# Altium schematic sheet Battery1.SchDoc
size A
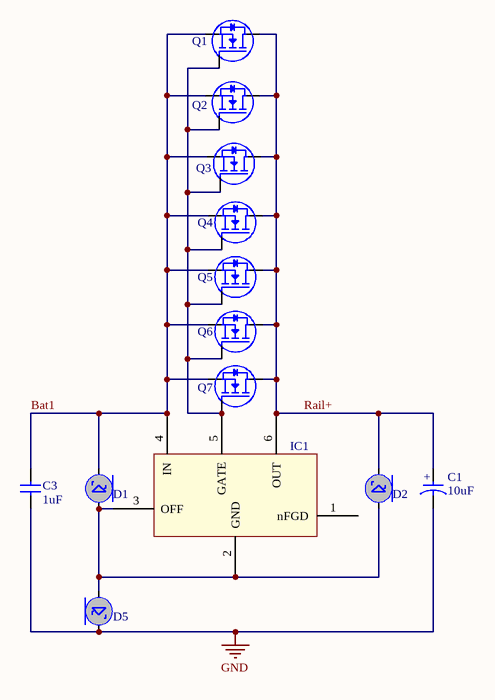
[diagram p0: Battery1.SchDoc]

## Parts
C1  value 10uF  [CAP22uF100V]  (hidden comment: CapPol)
C3  value 1uF  [CAPC1206]  (hidden comment: Cap)
D1  Schottky  [SS110-TP]  (value not drawn)
D2  SMBJ100A-13-F  [SMBJ100A-13-F]  (value not drawn)
D5  Schottky  [SS110-TP]  (value not drawn)
IC1  LM5050MK-2/NOPB  [LM5050MK-2/NOPB]  (value not drawn)
Q1  CSD19502Q5B  [CSD19502Q5B]  (value not drawn)
Q2  CSD19502Q5B  [CSD19502Q5B]  (value not drawn)
Q3  CSD19502Q5B  [CSD19502Q5B]  (value not drawn)
Q4  CSD19502Q5B  [CSD19502Q5B]  (value not drawn)
Q5  CSD19502Q5B  [CSD19502Q5B]  (value not drawn)
Q6  CSD19502Q5B  [CSD19502Q5B]  (value not drawn)
Q7  CSD19502Q5B  [CSD19502Q5B]  (value not drawn)

## Nets
GND: C1.2(B) C3.2(B) D5.C
Bat1: C3.1(A) D1.C IC1.4(IN) Q1.S Q2.S Q3.S Q4.S Q5.S Q6.S Q7.S
Rail+: C1.1(A) D2.C IC1.6(OUT) Q1.D Q2.D Q3.D Q4.D Q5.D Q6.D Q7.D
NetD1_A: D1.A D2.A D5.A IC1.2(GND) IC1.3(OFF)
NetIC1_5: IC1.5(GATE) Q1.G Q2.G Q3.G Q4.G Q5.G Q6.G Q7.G

Not connected (* = marked no-connect by the designer): IC1 1(nFGD)

## Notes on the sheet
- (in symbol CapPol) +

## Library data of the parts
D1 D5 = Schottky: Schottky Diode Template; Supplier 1: Digi-Key; Supplier Part Number 1: SS110-TPDKR-ND
D2 = SMBJ100A-13-F: TVS DIODE 100VWM 162VC SMB; Supplier 1: Digi-Key; Supplier Part Number 1: SMBJ100A-FDIDKR-ND
IC1 = LM5050MK-2/NOPB: IC OR CTRLR N+1 6SOT; Supplier 1: Digi-Key; Supplier Part Number 1: LM5050MK-2/NOPBDKR-ND
Q1-Q7 = CSD19502Q5B: NEXFET Power MOSFET; Supplier 1: Digi-Key; Supplier Part Number 1: 296-37194-1-ND
C1 = CapPol: Supplier 1: Digi-Key; Supplier Part Number 1: P5853-ND
C3 = Cap: Supplier 1: Digi-Key; Supplier Part Number 1: 587-1777-1-ND